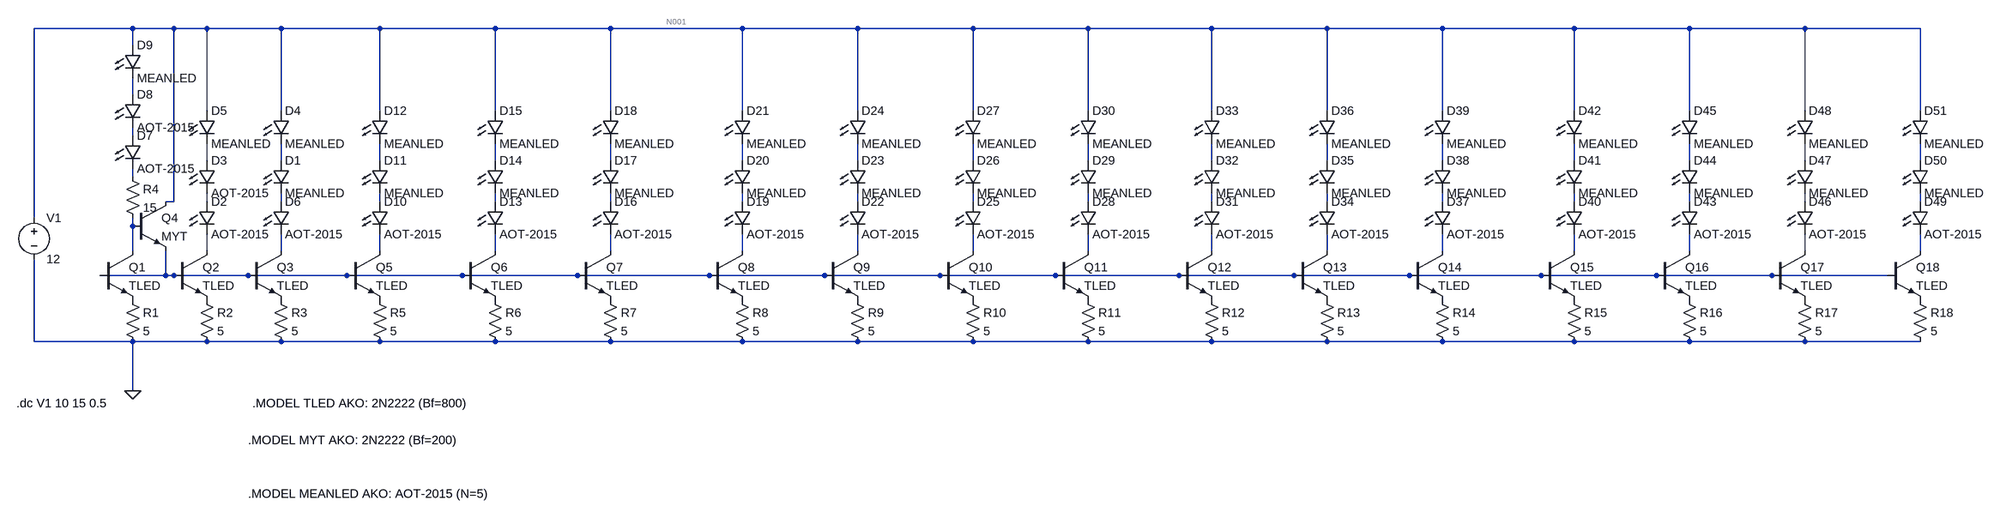
[diagram p0: schematic CircuitSimulation.asc]
CircuitSimulation.asc, the LTspice schematic file:
Version 4
SHEET 1 3776 680
WIRE 176 -448 -16 -448
WIRE 256 -448 176 -448
WIRE 320 -448 256 -448
WIRE 464 -448 320 -448
WIRE 656 -448 464 -448
WIRE 880 -448 656 -448
WIRE 1104 -448 880 -448
WIRE 1360 -448 1104 -448
WIRE 1584 -448 1360 -448
WIRE 1808 -448 1584 -448
WIRE 2032 -448 1808 -448
WIRE 2272 -448 2032 -448
WIRE 2496 -448 2272 -448
WIRE 2720 -448 2496 -448
WIRE 2976 -448 2720 -448
WIRE 3200 -448 2976 -448
WIRE 3424 -448 3200 -448
WIRE 3648 -448 3424 -448
WIRE 176 -416 176 -448
WIRE 176 -320 176 -352
WIRE 320 -288 320 -448
WIRE 464 -288 464 -448
WIRE 656 -288 656 -448
WIRE 880 -288 880 -448
WIRE 1104 -288 1104 -448
WIRE 1360 -288 1360 -448
WIRE 1584 -288 1584 -448
WIRE 1808 -288 1808 -448
WIRE 2032 -288 2032 -448
WIRE 2272 -288 2272 -448
WIRE 2496 -288 2496 -448
WIRE 2720 -288 2720 -448
WIRE 2976 -288 2976 -448
WIRE 3200 -288 3200 -448
WIRE 3424 -288 3424 -448
WIRE 3648 -288 3648 -448
WIRE 176 -240 176 -256
WIRE 320 -192 320 -224
WIRE 464 -192 464 -224
WIRE 656 -192 656 -224
WIRE 880 -192 880 -224
WIRE 1104 -192 1104 -224
WIRE 1360 -192 1360 -224
WIRE 1584 -192 1584 -224
WIRE 1808 -192 1808 -224
WIRE 2032 -192 2032 -224
WIRE 2272 -192 2272 -224
WIRE 2496 -192 2496 -224
WIRE 2720 -192 2720 -224
WIRE 2976 -192 2976 -224
WIRE 3200 -192 3200 -224
WIRE 3424 -192 3424 -224
WIRE 3648 -192 3648 -224
WIRE 176 -160 176 -176
WIRE 256 -112 256 -448
WIRE 256 -112 240 -112
WIRE 320 -112 320 -128
WIRE 464 -112 464 -128
WIRE 656 -112 656 -128
WIRE 880 -112 880 -128
WIRE 1104 -112 1104 -128
WIRE 1360 -112 1360 -128
WIRE 1584 -112 1584 -128
WIRE 1808 -112 1808 -128
WIRE 2032 -112 2032 -128
WIRE 2272 -112 2272 -128
WIRE 2496 -112 2496 -128
WIRE 2720 -112 2720 -128
WIRE 2976 -112 2976 -128
WIRE 3200 -112 3200 -128
WIRE 3424 -112 3424 -128
WIRE 3648 -112 3648 -128
WIRE -16 -80 -16 -448
WIRE 176 -64 176 -80
WIRE 176 -16 176 -64
WIRE 320 -16 320 -48
WIRE 464 -16 464 -48
WIRE 656 -16 656 -48
WIRE 880 -16 880 -48
WIRE 1104 -16 1104 -48
WIRE 1360 -16 1360 -48
WIRE 1584 -16 1584 -48
WIRE 1808 -16 1808 -48
WIRE 2032 -16 2032 -48
WIRE 2272 -16 2272 -48
WIRE 2496 -16 2496 -48
WIRE 2720 -16 2720 -48
WIRE 2976 -16 2976 -48
WIRE 3200 -16 3200 -48
WIRE 3424 -16 3424 -48
WIRE 3648 -16 3648 -48
WIRE 240 32 240 -16
WIRE 240 32 112 32
WIRE 256 32 240 32
WIRE 400 32 256 32
WIRE 592 32 400 32
WIRE 816 32 592 32
WIRE 1040 32 816 32
WIRE 1296 32 1040 32
WIRE 1520 32 1296 32
WIRE 1744 32 1520 32
WIRE 1968 32 1744 32
WIRE 2208 32 1968 32
WIRE 2432 32 2208 32
WIRE 2656 32 2432 32
WIRE 2912 32 2656 32
WIRE 3136 32 2912 32
WIRE 3360 32 3136 32
WIRE 3584 32 3360 32
WIRE -16 160 -16 0
WIRE 176 160 -16 160
WIRE 320 160 176 160
WIRE 464 160 320 160
WIRE 656 160 464 160
WIRE 880 160 656 160
WIRE 1104 160 880 160
WIRE 1360 160 1104 160
WIRE 1584 160 1360 160
WIRE 1808 160 1584 160
WIRE 2032 160 1808 160
WIRE 2272 160 2032 160
WIRE 2496 160 2272 160
WIRE 2720 160 2496 160
WIRE 2976 160 2720 160
WIRE 3200 160 2976 160
WIRE 3424 160 3200 160
WIRE 3648 160 3424 160
WIRE 176 256 176 160
FLAG 176 256 0
SYMBOL res 160 64 R0
SYMATTR InstName R1
SYMATTR Value 5
SYMBOL res 304 64 R0
SYMATTR InstName R2
SYMATTR Value 5
SYMBOL res 448 64 R0
SYMATTR InstName R3
SYMATTR Value 5
SYMBOL res 160 -176 R0
SYMATTR InstName R4
SYMATTR Value 15
SYMBOL LED 304 -112 R0
SYMATTR InstName D2
SYMATTR Value AOT-2015
SYMBOL LED 304 -192 R0
SYMATTR InstName D3
SYMATTR Value AOT-2015
SYMBOL LED 448 -112 R0
SYMATTR InstName D6
SYMATTR Value AOT-2015
SYMBOL LED 448 -192 R0
SYMATTR InstName D1
SYMATTR Value MEANLED
SYMBOL LED 448 -288 R0
SYMATTR InstName D4
SYMATTR Value MEANLED
SYMBOL LED 304 -288 R0
SYMATTR InstName D5
SYMATTR Value MEANLED
SYMBOL voltage -16 -96 R0
WINDOW 123 0 0 Left 0
WINDOW 39 0 0 Left 0
SYMATTR InstName V1
SYMATTR Value 12
SYMBOL npn 112 -16 R0
SYMATTR InstName Q1
SYMATTR Value TLED
SYMBOL npn 256 -16 R0
SYMATTR InstName Q2
SYMATTR Value TLED
SYMBOL npn 400 -16 R0
SYMATTR InstName Q3
SYMATTR Value TLED
SYMBOL npn 176 -112 R0
SYMATTR InstName Q4
SYMATTR Value MYT
SYMBOL LED 160 -240 R0
SYMATTR InstName D7
SYMATTR Value AOT-2015
SYMBOL LED 160 -320 R0
SYMATTR InstName D8
SYMATTR Value AOT-2015
SYMBOL LED 160 -416 R0
SYMATTR InstName D9
SYMATTR Value MEANLED
SYMBOL res 640 64 R0
SYMATTR InstName R5
SYMATTR Value 5
SYMBOL LED 640 -112 R0
SYMATTR InstName D10
SYMATTR Value AOT-2015
SYMBOL LED 640 -192 R0
SYMATTR InstName D11
SYMATTR Value MEANLED
SYMBOL LED 640 -288 R0
SYMATTR InstName D12
SYMATTR Value MEANLED
SYMBOL npn 592 -16 R0
SYMATTR InstName Q5
SYMATTR Value TLED
SYMBOL res 864 64 R0
SYMATTR InstName R6
SYMATTR Value 5
SYMBOL LED 864 -112 R0
SYMATTR InstName D13
SYMATTR Value AOT-2015
SYMBOL LED 864 -192 R0
SYMATTR InstName D14
SYMATTR Value MEANLED
SYMBOL LED 864 -288 R0
SYMATTR InstName D15
SYMATTR Value MEANLED
SYMBOL npn 816 -16 R0
SYMATTR InstName Q6
SYMATTR Value TLED
SYMBOL res 1088 64 R0
SYMATTR InstName R7
SYMATTR Value 5
SYMBOL LED 1088 -112 R0
SYMATTR InstName D16
SYMATTR Value AOT-2015
SYMBOL LED 1088 -192 R0
SYMATTR InstName D17
SYMATTR Value MEANLED
SYMBOL LED 1088 -288 R0
SYMATTR InstName D18
SYMATTR Value MEANLED
SYMBOL npn 1040 -16 R0
SYMATTR InstName Q7
SYMATTR Value TLED
SYMBOL res 1344 64 R0
SYMATTR InstName R8
SYMATTR Value 5
SYMBOL LED 1344 -112 R0
SYMATTR InstName D19
SYMATTR Value AOT-2015
SYMBOL LED 1344 -192 R0
SYMATTR InstName D20
SYMATTR Value MEANLED
SYMBOL LED 1344 -288 R0
SYMATTR InstName D21
SYMATTR Value MEANLED
SYMBOL npn 1296 -16 R0
SYMATTR InstName Q8
SYMATTR Value TLED
SYMBOL res 1568 64 R0
SYMATTR InstName R9
SYMATTR Value 5
SYMBOL LED 1568 -112 R0
SYMATTR InstName D22
SYMATTR Value AOT-2015
SYMBOL LED 1568 -192 R0
SYMATTR InstName D23
SYMATTR Value MEANLED
SYMBOL LED 1568 -288 R0
SYMATTR InstName D24
SYMATTR Value MEANLED
SYMBOL npn 1520 -16 R0
SYMATTR InstName Q9
SYMATTR Value TLED
SYMBOL res 1792 64 R0
SYMATTR InstName R10
SYMATTR Value 5
SYMBOL LED 1792 -112 R0
SYMATTR InstName D25
SYMATTR Value AOT-2015
SYMBOL LED 1792 -192 R0
SYMATTR InstName D26
SYMATTR Value MEANLED
SYMBOL LED 1792 -288 R0
SYMATTR InstName D27
SYMATTR Value MEANLED
SYMBOL npn 1744 -16 R0
SYMATTR InstName Q10
SYMATTR Value TLED
SYMBOL res 2016 64 R0
SYMATTR InstName R11
SYMATTR Value 5
SYMBOL LED 2016 -112 R0
SYMATTR InstName D28
SYMATTR Value AOT-2015
SYMBOL LED 2016 -192 R0
SYMATTR InstName D29
SYMATTR Value MEANLED
SYMBOL LED 2016 -288 R0
SYMATTR InstName D30
SYMATTR Value MEANLED
SYMBOL npn 1968 -16 R0
SYMATTR InstName Q11
SYMATTR Value TLED
SYMBOL res 2256 64 R0
SYMATTR InstName R12
SYMATTR Value 5
SYMBOL LED 2256 -112 R0
SYMATTR InstName D31
SYMATTR Value AOT-2015
SYMBOL LED 2256 -192 R0
SYMATTR InstName D32
SYMATTR Value MEANLED
SYMBOL LED 2256 -288 R0
SYMATTR InstName D33
SYMATTR Value MEANLED
SYMBOL npn 2208 -16 R0
SYMATTR InstName Q12
SYMATTR Value TLED
SYMBOL res 2480 64 R0
SYMATTR InstName R13
SYMATTR Value 5
SYMBOL LED 2480 -112 R0
SYMATTR InstName D34
SYMATTR Value AOT-2015
SYMBOL LED 2480 -192 R0
SYMATTR InstName D35
SYMATTR Value MEANLED
SYMBOL LED 2480 -288 R0
SYMATTR InstName D36
SYMATTR Value MEANLED
SYMBOL npn 2432 -16 R0
SYMATTR InstName Q13
SYMATTR Value TLED
SYMBOL res 2704 64 R0
SYMATTR InstName R14
SYMATTR Value 5
SYMBOL LED 2704 -112 R0
SYMATTR InstName D37
SYMATTR Value AOT-2015
SYMBOL LED 2704 -192 R0
SYMATTR InstName D38
SYMATTR Value MEANLED
SYMBOL LED 2704 -288 R0
SYMATTR InstName D39
SYMATTR Value MEANLED
SYMBOL npn 2656 -16 R0
SYMATTR InstName Q14
SYMATTR Value TLED
SYMBOL res 2960 64 R0
SYMATTR InstName R15
SYMATTR Value 5
SYMBOL LED 2960 -112 R0
SYMATTR InstName D40
SYMATTR Value AOT-2015
SYMBOL LED 2960 -192 R0
SYMATTR InstName D41
SYMATTR Value MEANLED
SYMBOL LED 2960 -288 R0
SYMATTR InstName D42
SYMATTR Value MEANLED
SYMBOL npn 2912 -16 R0
SYMATTR InstName Q15
SYMATTR Value TLED
SYMBOL res 3184 64 R0
SYMATTR InstName R16
SYMATTR Value 5
SYMBOL LED 3184 -112 R0
SYMATTR InstName D43
SYMATTR Value AOT-2015
SYMBOL LED 3184 -192 R0
SYMATTR InstName D44
SYMATTR Value MEANLED
SYMBOL LED 3184 -288 R0
SYMATTR InstName D45
SYMATTR Value MEANLED
SYMBOL npn 3136 -16 R0
SYMATTR InstName Q16
SYMATTR Value TLED
SYMBOL res 3408 64 R0
SYMATTR InstName R17
SYMATTR Value 5
SYMBOL LED 3408 -112 R0
SYMATTR InstName D46
SYMATTR Value AOT-2015
SYMBOL LED 3408 -192 R0
SYMATTR InstName D47
SYMATTR Value MEANLED
SYMBOL LED 3408 -288 R0
SYMATTR InstName D48
SYMATTR Value MEANLED
SYMBOL npn 3360 -16 R0
SYMATTR InstName Q17
SYMATTR Value TLED
SYMBOL res 3632 64 R0
SYMATTR InstName R18
SYMATTR Value 5
SYMBOL LED 3632 -112 R0
SYMATTR InstName D49
SYMATTR Value AOT-2015
SYMBOL LED 3632 -192 R0
SYMATTR InstName D50
SYMATTR Value MEANLED
SYMBOL LED 3632 -288 R0
SYMATTR InstName D51
SYMATTR Value MEANLED
SYMBOL npn 3584 -16 R0
SYMATTR InstName Q18
SYMATTR Value TLED
TEXT -50 280 Left 2 !.dc V1 10 15 0.5
TEXT 400 352 Left 2 !.MODEL MYT AKO: 2N2222 (Bf=200)
TEXT 400 456 Left 2 !.MODEL MEANLED AKO: AOT-2015 (N=5)
TEXT 408 280 Left 2 !.MODEL TLED AKO: 2N2222 (Bf=800)

The netlist it stands for:
* CircuitSimulation.asc
R1 P001 0 5
R2 P002 0 5
R3 P003 0 5
R4 N020 N037 15
D2 N021 N038 AOT-2015
D3 N004 N021 AOT-2015
D6 N022 N039 AOT-2015
D1 N005 N022 MEANLED
D4 N001 N005 MEANLED
D5 N001 N004 MEANLED
V1 N001 0 12
Q1 N037 N054 P001 0 TLED
Q2 N038 N054 P002 0 TLED
Q3 N039 N054 P003 0 TLED
Q4 N001 N037 N054 0 MYT
D7 N003 N020 AOT-2015
D8 N002 N003 AOT-2015
D9 N001 N002 MEANLED
R5 P004 0 5
D10 N023 N040 AOT-2015
D11 N006 N023 MEANLED
D12 N001 N006 MEANLED
Q5 N040 N054 P004 0 TLED
R6 P005 0 5
D13 N024 N041 AOT-2015
D14 N007 N024 MEANLED
D15 N001 N007 MEANLED
Q6 N041 N054 P005 0 TLED
R7 P006 0 5
D16 N025 N042 AOT-2015
D17 N008 N025 MEANLED
D18 N001 N008 MEANLED
Q7 N042 N054 P006 0 TLED
R8 P007 0 5
D19 N026 N043 AOT-2015
D20 N009 N026 MEANLED
D21 N001 N009 MEANLED
Q8 N043 N054 P007 0 TLED
R9 P008 0 5
D22 N027 N044 AOT-2015
D23 N010 N027 MEANLED
D24 N001 N010 MEANLED
Q9 N044 N054 P008 0 TLED
R10 P009 0 5
D25 N028 N045 AOT-2015
D26 N011 N028 MEANLED
D27 N001 N011 MEANLED
Q10 N045 N054 P009 0 TLED
R11 P010 0 5
D28 N029 N046 AOT-2015
D29 N012 N029 MEANLED
D30 N001 N012 MEANLED
Q11 N046 N054 P010 0 TLED
R12 P011 0 5
D31 N030 N047 AOT-2015
D32 N013 N030 MEANLED
D33 N001 N013 MEANLED
Q12 N047 N054 P011 0 TLED
R13 P012 0 5
D34 N031 N048 AOT-2015
D35 N014 N031 MEANLED
D36 N001 N014 MEANLED
Q13 N048 N054 P012 0 TLED
R14 P013 0 5
D37 N032 N049 AOT-2015
D38 N015 N032 MEANLED
D39 N001 N015 MEANLED
Q14 N049 N054 P013 0 TLED
R15 P014 0 5
D40 N033 N050 AOT-2015
D41 N016 N033 MEANLED
D42 N001 N016 MEANLED
Q15 N050 N054 P014 0 TLED
R16 P015 0 5
D43 N034 N051 AOT-2015
D44 N017 N034 MEANLED
D45 N001 N017 MEANLED
Q16 N051 N054 P015 0 TLED
R17 P016 0 5
D46 N035 N052 AOT-2015
D47 N018 N035 MEANLED
D48 N001 N018 MEANLED
Q17 N052 N054 P016 0 TLED
R18 P017 0 5
D49 N036 N053 AOT-2015
D50 N019 N036 MEANLED
D51 N001 N019 MEANLED
Q18 N053 N054 P017 0 TLED
.model D D
.lib standard.dio
.model NPN NPN
.model PNP PNP
.lib standard.bjt
.dc V1 10 15 0.5
.MODEL MYT AKO: 2N2222 (Bf=200)
.MODEL MEANLED AKO: AOT-2015 (N=5)
.MODEL TLED AKO: 2N2222 (Bf=800)
.backanno
.end

* Results of the author's LTspice run, read from the files saved beside the schematic
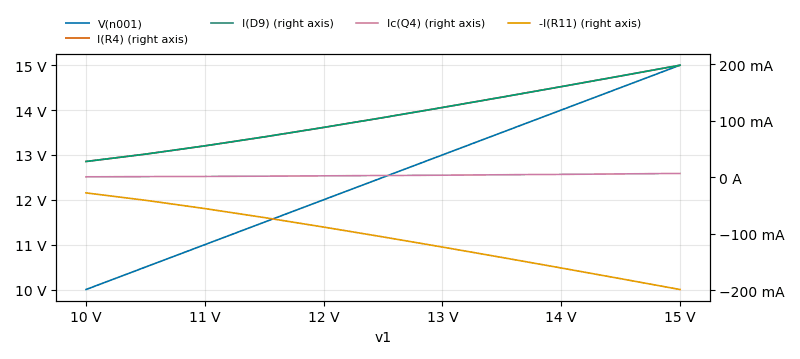
[diagram p1: DC transfer characteristic of CircuitSimulation.asc, plotted from the saved traces]
* DC transfer characteristic, 1 run:
*   V(n001): 10 V at v1=10 V, 15 V at v1=15 V, min 10 V, max 15 V
*   I(R4): 27.73 mA at v1=10 V, 197.9 mA at v1=15 V, min 27.73 mA, max 197.9 mA
*   I(D9): 27.73 mA at v1=10 V, 197.9 mA at v1=15 V, min 27.73 mA, max 197.9 mA
*   Ic(Q4): 631.3 µA at v1=10 V, 6.593 mA at v1=15 V, min 631.3 µA, max 6.593 mA
*   -I(R11): -27.81 mA at v1=10 V, -198.6 mA at v1=15 V, min -198.6 mA, max -27.81 mA